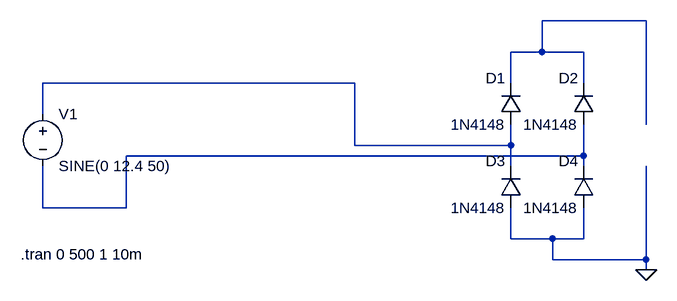
[diagram p0: schematic Power_Tr_Module.asc]
Power_Tr_Module.asc, the LTspice schematic file:
Version 4
SHEET 1 880 680
WIRE 736 48 576 48
WIRE 576 96 576 48
WIRE 576 96 528 96
WIRE 640 96 576 96
WIRE 288 144 -192 144
WIRE 528 144 528 96
WIRE 640 144 640 96
WIRE -192 192 -192 144
WIRE 736 208 736 48
WIRE 288 240 288 144
WIRE 528 240 528 208
WIRE 528 240 288 240
WIRE 640 256 640 208
WIRE 640 256 -64 256
WIRE 528 272 528 240
WIRE 640 272 640 256
WIRE -192 336 -192 272
WIRE -64 336 -64 256
WIRE -64 336 -192 336
WIRE 528 384 528 336
WIRE 592 384 528 384
WIRE 640 384 640 336
WIRE 640 384 592 384
WIRE 592 416 592 384
WIRE 736 416 736 272
WIRE 736 416 592 416
WIRE 736 432 736 416
FLAG 736 432 0
SYMBOL voltage -192 176 R0
WINDOW 123 0 0 Left 0
WINDOW 39 0 0 Left 0
SYMATTR InstName V1
SYMATTR Value SINE(0 12.4 50)
SYMBOL diode 544 208 R180
WINDOW 0 24 72 Left 0
WINDOW 3 24 0 Left 0
SYMATTR InstName D1
SYMATTR Value 1N4148
SYMBOL diode 656 208 R180
WINDOW 0 24 72 Left 0
WINDOW 3 24 0 Left 0
SYMATTR InstName D2
SYMATTR Value 1N4148
SYMBOL diode 544 336 R180
WINDOW 0 24 72 Left 0
WINDOW 3 24 0 Left 0
SYMATTR InstName D3
SYMATTR Value 1N4148
SYMBOL diode 656 336 R180
WINDOW 0 24 72 Left 0
WINDOW 3 24 0 Left 0
SYMATTR InstName D4
SYMATTR Value 1N4148
TEXT -226 408 Left 0 !.tran 0 500 1 10m

The netlist it stands for:
* Power_Tr_Module.asc
V1 N002 N003 SINE(0 12.4 50)
D1 N002 N001 1N4148
D2 N003 N001 1N4148
D3 0 N002 1N4148
D4 0 N003 1N4148
.model D D
.lib standard.dio
.tran 0 500 1 10m
.backanno
.end